# Altium project PCB_Project1.PrjPCB
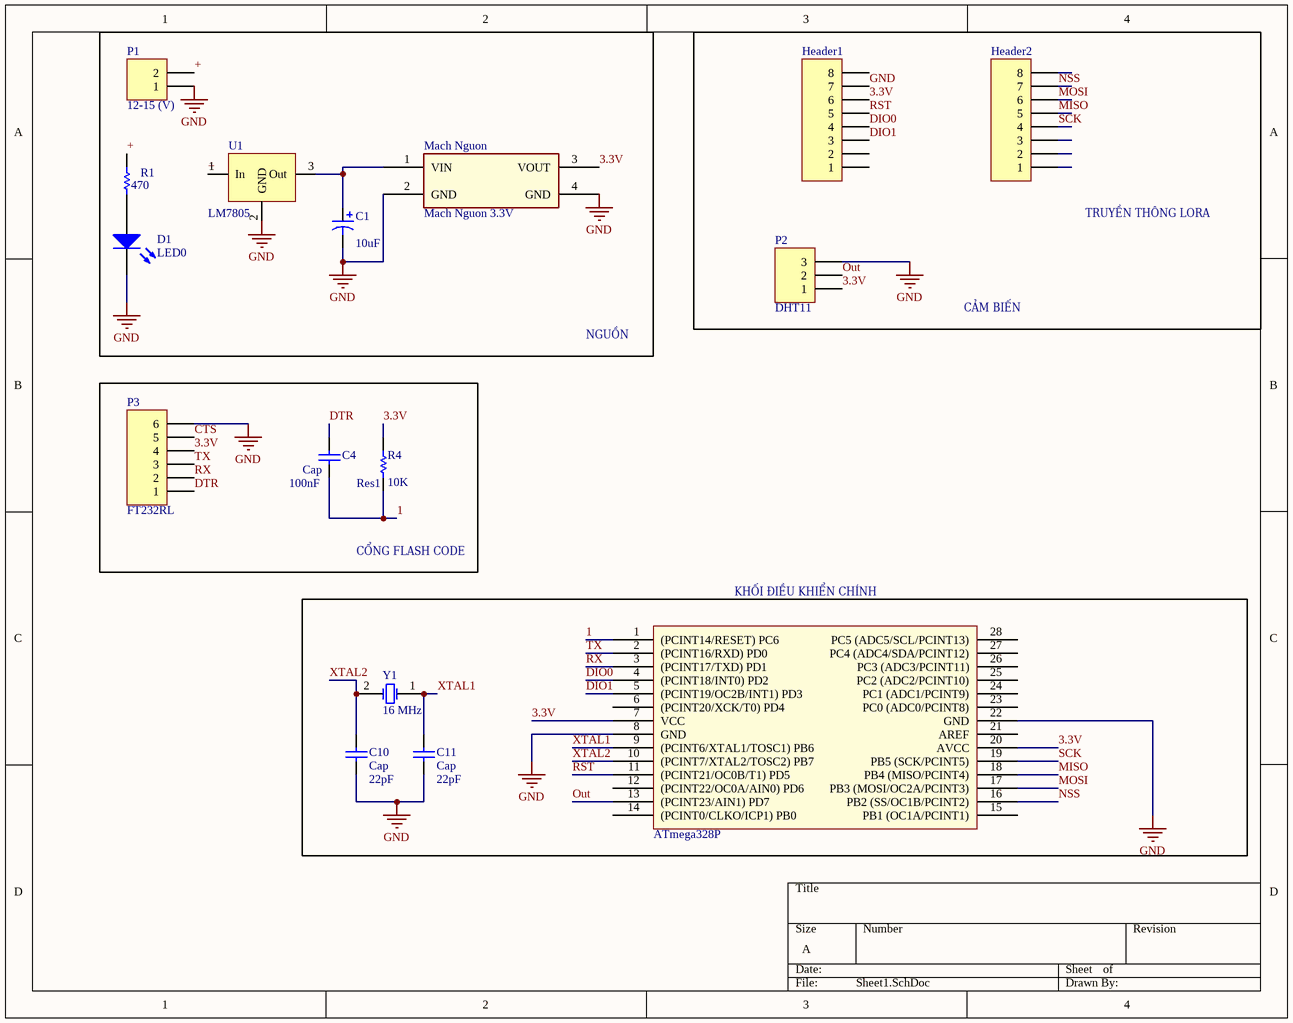
[diagram p0: Sheet1.SchDoc]
1 sheet, 16 parts. Net scope: global (net labels, ports and power ports of the same name join across sheets).
Board files: PCB1.PcbDoc, PCB2.PcbDoc

## Sheet Sheet1.SchDoc
size A

### Parts
ATmega328P  ATmega328P  [DIP794W46P254L2967H457Q28B]  (value not drawn)
C1  value 10uF  [RB7.6-15]  (hidden comment: Cap Pol1)
C4  Cap  value 100nF  [RAD-0.3]
C10  Cap  value 22pF  [RAD-0.3]
C11  Cap  value 22pF  [RAD-0.3]
D1  LED0  [LED-0]
Header1  (no value)  [HDR1X8]
Header2  (no value)  [HDR1X8]
Mach_Nguon  Mach Nguon 3.3V  [PCBComponent_1]
P1  12-15 (V)  [HDR1X2]
P2  DHT11  [HDR1X3]
P3  FT232RL  [HDR1X6]
R1  value 470  [AXIAL-0.3]  (hidden comment: Res1)
R4  Res1  value 10K  [AXIAL-0.3]
U1  LM7805  [TO92-]
Y1  16 MHz  [R38]

### Blocks framed on the sheet
NGUỒN: C1 D1 Mach_Nguon P1 R1 U1
CỔNG FLASH CODE: C4 P3 R4
KHỐI ĐIỀU KHIỂN CHÍNH: ATmega328P C10 C11 Y1

### Nets
GND: ATmega328P.8(GND) ATmega328P.22(GND) C1.2 C10.1 C11.1 D1.2(K) Header1.7 Mach_Nguon.2(GND) Mach_Nguon.4(GND) P1.1 P2.3 P3.6 U1.2(GND)
1: ATmega328P.1((PCINT14/RESET)_PC6) C4.1 R4.1
3.3V: ATmega328P.7(VCC) ATmega328P.20(AVCC) Header1.6 Mach_Nguon.3(VOUT) P2.1 P3.4 R4.2
+: P1.2 R1.2 U1.1(In)
CTS: P3.5
DIO0: ATmega328P.4((PCINT18/INT0)_PD2) Header1.4
DIO1: ATmega328P.5((PCINT19/OC2B/INT1)_PD3) Header1.3
DTR: C4.2 P3.1
MISO: ATmega328P.18(PB4_(MISO/PCINT4)) Header2.5
MOSI: ATmega328P.17(PB3_(MOSI/OC2A/PCINT3)) Header2.6
NSS: ATmega328P.16(PB2_(SS/OC1B/PCINT2)) Header2.7
Out: ATmega328P.13((PCINT23/AIN1)_PD7) P2.2
RST: ATmega328P.11((PCINT21/OC0B/T1)_PD5) Header1.5
RX: ATmega328P.3((PCINT17/TXD)_PD1) P3.2
SCK: ATmega328P.19(PB5_(SCK/PCINT5)) Header2.4
TX: ATmega328P.2((PCINT16/RXD)_PD0) P3.3
XTAL1: ATmega328P.9((PCINT6/XTAL1/TOSC1)_PB6) C11.2 Y1.1(OSC1)
XTAL2: ATmega328P.10((PCINT7/XTAL2/TOSC2)_PB7) C10.2 Y1.2(OSC2)
NetC1_1: C1.1 Mach_Nguon.1(VIN) U1.3(Out)
NetD1_1: D1.1(A) R1.1

Not connected (* = marked no-connect by the designer): ATmega328P 6((PCINT20/XCK/T0)_PD4) 12((PCINT22/OC0A/AIN0)_PD6) 14((PCINT0/CLKO/ICP1)_PB0) 15(PB1_(OC1A/PCINT1)) 21(AREF) 23(PC0_(ADC0/PCINT8)) 24(PC1_(ADC1/PCINT9)) 25(PC2_(ADC2/PCINT10)) 26(PC3_(ADC3/PCINT11)) 27(PC4_(ADC4/SDA/PCINT12)) 28(PC5_(ADC5/SCL/PCINT13)); Header1 1 2 8; Header2 1 2 3 8

### Notes on the sheet
- TRUYỀN THÔNG LORA
- CẢM BIẾN

### Library data of the parts
C1 = Cap Pol1: Polarized Capacitor (Radial); Published: 8-Jun-2000; LatestRevisionDate: 17-Jul-2002; LatestRevisionNote: Re-released for DXP Platform.; PackageReference: RB7.6-15; Publisher: Altium Limited; PackageDescription: Polarized Capacitor (Radial); 2 Leads
C4 C10 C11 = Cap: Capacitor; Published: 8-Jun-2000; LatestRevisionDate: 17-Jul-2002; LatestRevisionNote: Re-released for DXP Platform.; PackageReference: RAD-0.3; Publisher: Altium Limited; PackageDescription: Radial Cap, Thru-Hole; 2 Leads; 0.3 in Pin Spacing
D1 = LED0: Typical INFRARED GaAs LED; Published: 8-Jun-2000; LatestRevisionDate: 08-Jul-2005; LatestRevisionNote: Mech Layer 1 removed.; PackageReference: LED-0; Publisher: Altium Limited; PackageDescription: LED; 2 Leads
Header1 Header2 = Header 8: Header, 8-Pin; LatestRevisionDate: 17-Jul-2002; LatestRevisionNote: Re-released for DXP Platform.; Publisher: Altium Limited
Mach_Nguon = Component_1
P1 = Header 2: Header, 2-Pin; LatestRevisionDate: 17-Jul-2002; LatestRevisionNote: Re-released for DXP Platform.; Publisher: Altium Limited
P2 = Header 3: Header, 3-Pin; LatestRevisionDate: 17-Jul-2002; LatestRevisionNote: Re-released for DXP Platform.; Publisher: Altium Limited
P3 = Header 6: Header, 6-Pin; LatestRevisionDate: 17-Jul-2002; LatestRevisionNote: Re-released for DXP Platform.; Publisher: Altium Limited
R1 R4 = Res1: Resistor; Published: 8-Jun-2000; LatestRevisionDate: 17-Jul-2002; LatestRevisionNote: Re-released for DXP Platform.; PackageReference: AXIAL-0.3; Publisher: Altium Limited; PackageDescription: Axial Device, Thru-Hole; 2 Leads; 0.3 in Pin Spacing
U1 = LM7805: IC REG LIN 5V 1A
Y1 = XTAL: Crystal Oscillator; Published: 8-Jun-2000; LatestRevisionDate: 17-Jul-2002; LatestRevisionNote: Re-released for DXP Platform.; PackageReference: R38; Publisher: Altium Limited; PackageDescription: Crystal, Thru-Hole; 2 Leads; Body 3.1 x 8.2 mm (Dia.xH)